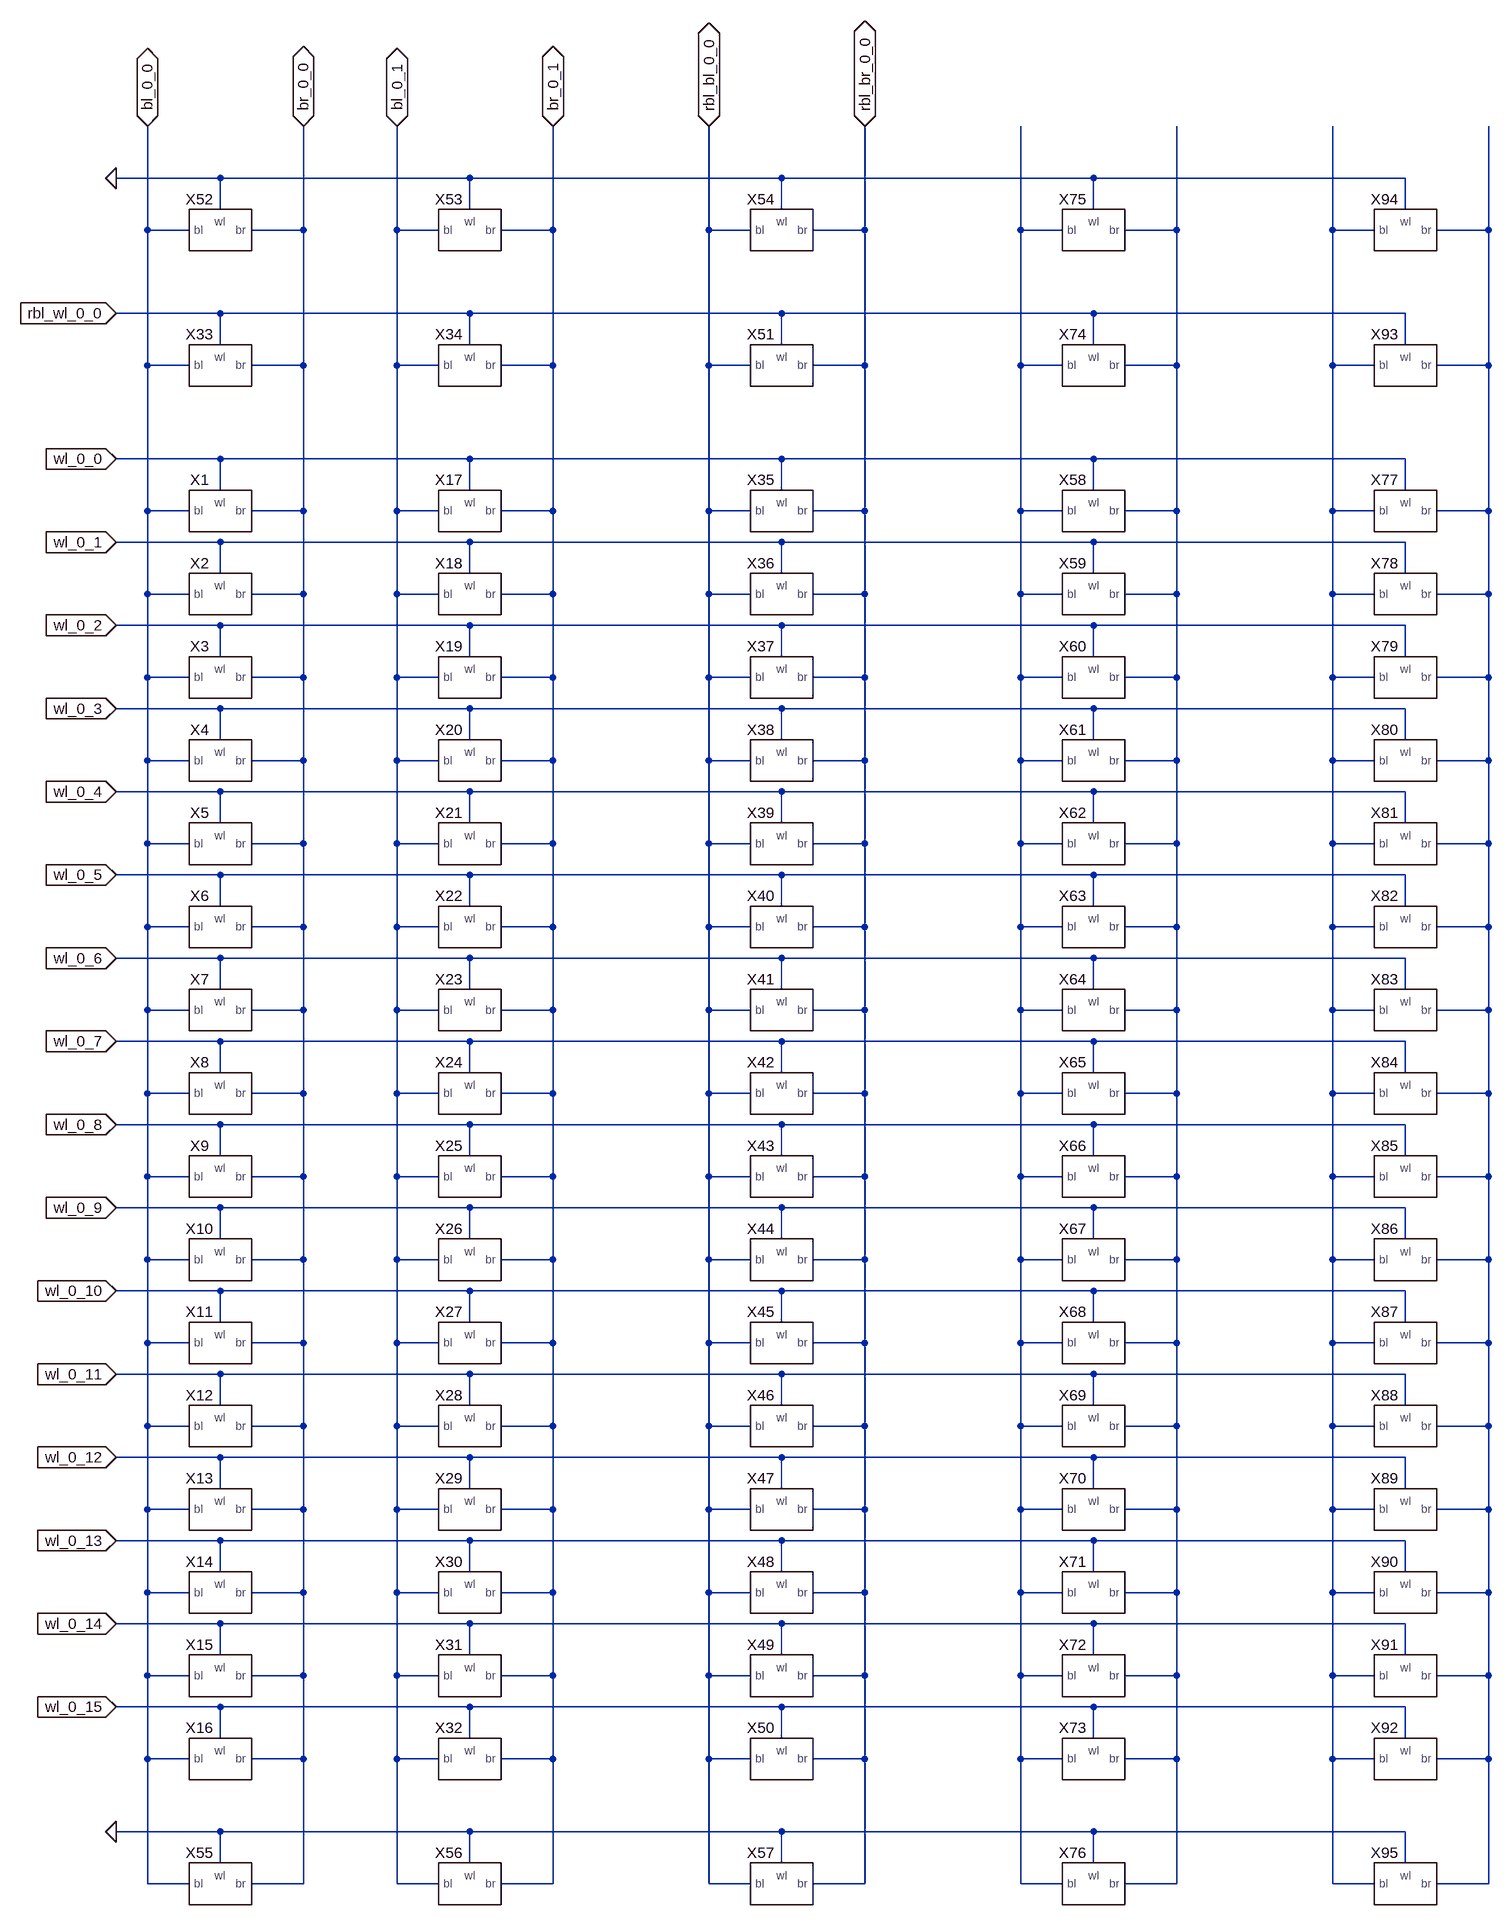
[diagram p0: schematic sram_16x2_bitcell_array_analysis.asc]
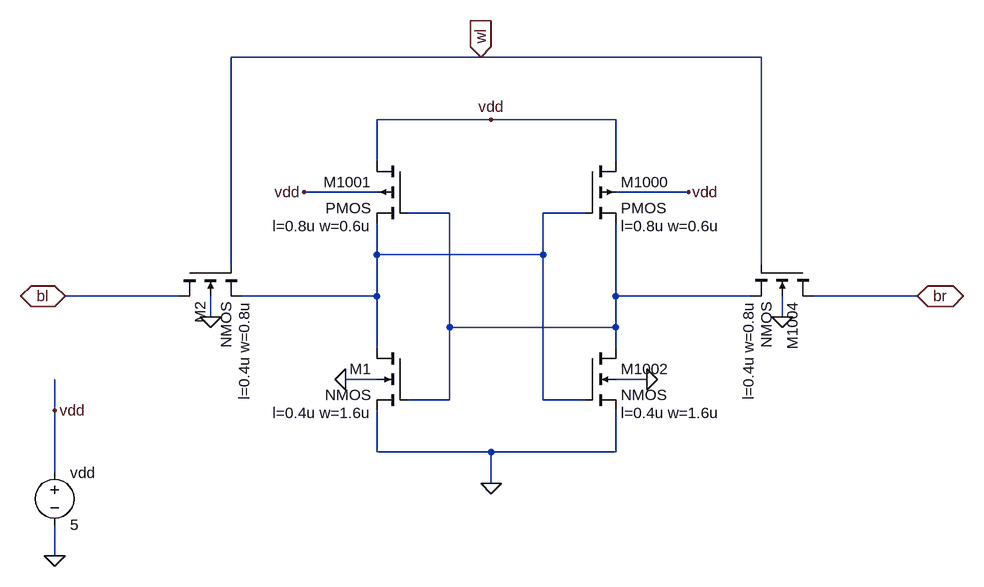
[diagram p1: sub-circuit cell_1rw.asc]
sram_16x2_bitcell_array_analysis.asc, the LTspice schematic file:
Version 4
SHEET 1 1192 1796
WIRE -848 -864 -1008 -864
WIRE -464 -864 -848 -864
WIRE 16 -864 -464 -864
WIRE 496 -864 16 -864
WIRE 976 -864 496 -864
WIRE -848 -816 -848 -864
WIRE -464 -816 -464 -864
WIRE 16 -816 16 -864
WIRE 496 -816 496 -864
WIRE 976 -816 976 -864
WIRE -960 -784 -960 -944
WIRE -896 -784 -960 -784
WIRE -720 -784 -720 -944
WIRE -720 -784 -800 -784
WIRE -576 -784 -576 -944
WIRE -512 -784 -576 -784
WIRE -336 -784 -336 -944
WIRE -336 -784 -416 -784
WIRE -96 -784 -96 -944
WIRE -32 -784 -96 -784
WIRE 144 -784 144 -944
WIRE 144 -784 64 -784
WIRE 384 -784 384 -944
WIRE 448 -784 384 -784
WIRE 624 -784 624 -944
WIRE 624 -784 544 -784
WIRE 864 -784 864 -944
WIRE 928 -784 864 -784
WIRE 1104 -784 1104 -944
WIRE 1104 -784 1024 -784
WIRE -848 -656 -1008 -656
WIRE -464 -656 -848 -656
WIRE 16 -656 -464 -656
WIRE 496 -656 16 -656
WIRE 976 -656 496 -656
WIRE -848 -608 -848 -656
WIRE -464 -608 -464 -656
WIRE 16 -608 16 -656
WIRE 496 -608 496 -656
WIRE 976 -608 976 -656
WIRE -960 -576 -960 -784
WIRE -896 -576 -960 -576
WIRE -720 -576 -720 -784
WIRE -720 -576 -800 -576
WIRE -576 -576 -576 -784
WIRE -512 -576 -576 -576
WIRE -336 -576 -336 -784
WIRE -336 -576 -416 -576
WIRE -96 -576 -96 -784
WIRE -32 -576 -96 -576
WIRE 144 -576 144 -784
WIRE 144 -576 64 -576
WIRE 384 -576 384 -784
WIRE 448 -576 384 -576
WIRE 624 -576 624 -784
WIRE 624 -576 544 -576
WIRE 864 -576 864 -784
WIRE 928 -576 864 -576
WIRE 1104 -576 1104 -784
WIRE 1104 -576 1024 -576
WIRE -848 -432 -1008 -432
WIRE -464 -432 -848 -432
WIRE 16 -432 -464 -432
WIRE 496 -432 16 -432
WIRE 976 -432 496 -432
WIRE -848 -384 -848 -432
WIRE -464 -384 -464 -432
WIRE 16 -384 16 -432
WIRE 496 -384 496 -432
WIRE 976 -384 976 -432
WIRE -960 -352 -960 -576
WIRE -896 -352 -960 -352
WIRE -720 -352 -720 -576
WIRE -720 -352 -800 -352
WIRE -576 -352 -576 -576
WIRE -512 -352 -576 -352
WIRE -336 -352 -336 -576
WIRE -336 -352 -416 -352
WIRE -96 -352 -96 -576
WIRE -32 -352 -96 -352
WIRE 144 -352 144 -576
WIRE 144 -352 64 -352
WIRE 384 -352 384 -576
WIRE 448 -352 384 -352
WIRE 624 -352 624 -576
WIRE 624 -352 544 -352
WIRE 864 -352 864 -576
WIRE 928 -352 864 -352
WIRE 1104 -352 1104 -576
WIRE 1104 -352 1024 -352
WIRE -848 -304 -1008 -304
WIRE -464 -304 -848 -304
WIRE 16 -304 -464 -304
WIRE 496 -304 16 -304
WIRE 976 -304 496 -304
WIRE -848 -256 -848 -304
WIRE -464 -256 -464 -304
WIRE 16 -256 16 -304
WIRE 496 -256 496 -304
WIRE 976 -256 976 -304
WIRE -960 -224 -960 -352
WIRE -896 -224 -960 -224
WIRE -720 -224 -720 -352
WIRE -720 -224 -800 -224
WIRE -576 -224 -576 -352
WIRE -512 -224 -576 -224
WIRE -336 -224 -336 -352
WIRE -336 -224 -416 -224
WIRE -96 -224 -96 -352
WIRE -32 -224 -96 -224
WIRE 144 -224 144 -352
WIRE 144 -224 64 -224
WIRE 384 -224 384 -352
WIRE 448 -224 384 -224
WIRE 624 -224 624 -352
WIRE 624 -224 544 -224
WIRE 864 -224 864 -352
WIRE 928 -224 864 -224
WIRE 1104 -224 1104 -352
WIRE 1104 -224 1024 -224
WIRE -848 -176 -1008 -176
WIRE -464 -176 -848 -176
WIRE 16 -176 -464 -176
WIRE 496 -176 16 -176
WIRE 976 -176 496 -176
WIRE -848 -128 -848 -176
WIRE -464 -128 -464 -176
WIRE 16 -128 16 -176
WIRE 496 -128 496 -176
WIRE 976 -128 976 -176
WIRE -960 -96 -960 -224
WIRE -896 -96 -960 -96
WIRE -720 -96 -720 -224
WIRE -720 -96 -800 -96
WIRE -576 -96 -576 -224
WIRE -512 -96 -576 -96
WIRE -336 -96 -336 -224
WIRE -336 -96 -416 -96
WIRE -96 -96 -96 -224
WIRE -32 -96 -96 -96
WIRE 144 -96 144 -224
WIRE 144 -96 64 -96
WIRE 384 -96 384 -224
WIRE 448 -96 384 -96
WIRE 624 -96 624 -224
WIRE 624 -96 544 -96
WIRE 864 -96 864 -224
WIRE 928 -96 864 -96
WIRE 1104 -96 1104 -224
WIRE 1104 -96 1024 -96
WIRE -848 -48 -1008 -48
WIRE -464 -48 -848 -48
WIRE 16 -48 -464 -48
WIRE 496 -48 16 -48
WIRE 976 -48 496 -48
WIRE -848 0 -848 -48
WIRE -464 0 -464 -48
WIRE 16 0 16 -48
WIRE 496 0 496 -48
WIRE 976 0 976 -48
WIRE -960 32 -960 -96
WIRE -896 32 -960 32
WIRE -720 32 -720 -96
WIRE -720 32 -800 32
WIRE -576 32 -576 -96
WIRE -512 32 -576 32
WIRE -336 32 -336 -96
WIRE -336 32 -416 32
WIRE -96 32 -96 -96
WIRE -32 32 -96 32
WIRE 144 32 144 -96
WIRE 144 32 64 32
WIRE 384 32 384 -96
WIRE 448 32 384 32
WIRE 624 32 624 -96
WIRE 624 32 544 32
WIRE 864 32 864 -96
WIRE 928 32 864 32
WIRE 1104 32 1104 -96
WIRE 1104 32 1024 32
WIRE -848 80 -1008 80
WIRE -464 80 -848 80
WIRE 16 80 -464 80
WIRE 496 80 16 80
WIRE 976 80 496 80
WIRE -848 128 -848 80
WIRE -464 128 -464 80
WIRE 16 128 16 80
WIRE 496 128 496 80
WIRE 976 128 976 80
WIRE -960 160 -960 32
WIRE -896 160 -960 160
WIRE -720 160 -720 32
WIRE -720 160 -800 160
WIRE -576 160 -576 32
WIRE -512 160 -576 160
WIRE -336 160 -336 32
WIRE -336 160 -416 160
WIRE -96 160 -96 32
WIRE -32 160 -96 160
WIRE 144 160 144 32
WIRE 144 160 64 160
WIRE 384 160 384 32
WIRE 448 160 384 160
WIRE 624 160 624 32
WIRE 624 160 544 160
WIRE 864 160 864 32
WIRE 928 160 864 160
WIRE 1104 160 1104 32
WIRE 1104 160 1024 160
WIRE -848 208 -1008 208
WIRE -464 208 -848 208
WIRE 16 208 -464 208
WIRE 496 208 16 208
WIRE 976 208 496 208
WIRE -848 256 -848 208
WIRE -464 256 -464 208
WIRE 16 256 16 208
WIRE 496 256 496 208
WIRE 976 256 976 208
WIRE -960 288 -960 160
WIRE -896 288 -960 288
WIRE -720 288 -720 160
WIRE -720 288 -800 288
WIRE -576 288 -576 160
WIRE -512 288 -576 288
WIRE -336 288 -336 160
WIRE -336 288 -416 288
WIRE -96 288 -96 160
WIRE -32 288 -96 288
WIRE 144 288 144 160
WIRE 144 288 64 288
WIRE 384 288 384 160
WIRE 448 288 384 288
WIRE 624 288 624 160
WIRE 624 288 544 288
WIRE 864 288 864 160
WIRE 928 288 864 288
WIRE 1104 288 1104 160
WIRE 1104 288 1024 288
WIRE -848 336 -1008 336
WIRE -464 336 -848 336
WIRE 16 336 -464 336
WIRE 496 336 16 336
WIRE 976 336 496 336
WIRE -848 384 -848 336
WIRE -464 384 -464 336
WIRE 16 384 16 336
WIRE 496 384 496 336
WIRE 976 384 976 336
WIRE -960 416 -960 288
WIRE -896 416 -960 416
WIRE -720 416 -720 288
WIRE -720 416 -800 416
WIRE -576 416 -576 288
WIRE -512 416 -576 416
WIRE -336 416 -336 288
WIRE -336 416 -416 416
WIRE -96 416 -96 288
WIRE -32 416 -96 416
WIRE 144 416 144 288
WIRE 144 416 64 416
WIRE 384 416 384 288
WIRE 448 416 384 416
WIRE 624 416 624 288
WIRE 624 416 544 416
WIRE 864 416 864 288
WIRE 928 416 864 416
WIRE 1104 416 1104 288
WIRE 1104 416 1024 416
WIRE -848 464 -1008 464
WIRE -464 464 -848 464
WIRE 16 464 -464 464
WIRE 496 464 16 464
WIRE 976 464 496 464
WIRE -848 512 -848 464
WIRE -464 512 -464 464
WIRE 16 512 16 464
WIRE 496 512 496 464
WIRE 976 512 976 464
WIRE -960 544 -960 416
WIRE -896 544 -960 544
WIRE -720 544 -720 416
WIRE -720 544 -800 544
WIRE -576 544 -576 416
WIRE -512 544 -576 544
WIRE -336 544 -336 416
WIRE -336 544 -416 544
WIRE -96 544 -96 416
WIRE -32 544 -96 544
WIRE 144 544 144 416
WIRE 144 544 64 544
WIRE 384 544 384 416
WIRE 448 544 384 544
WIRE 624 544 624 416
WIRE 624 544 544 544
WIRE 864 544 864 416
WIRE 928 544 864 544
WIRE 1104 544 1104 416
WIRE 1104 544 1024 544
WIRE -848 592 -1008 592
WIRE -464 592 -848 592
WIRE 16 592 -464 592
WIRE 496 592 16 592
WIRE 976 592 496 592
WIRE -848 640 -848 592
WIRE -464 640 -464 592
WIRE 16 640 16 592
WIRE 496 640 496 592
WIRE 976 640 976 592
WIRE -960 672 -960 544
WIRE -896 672 -960 672
WIRE -720 672 -720 544
WIRE -720 672 -800 672
WIRE -576 672 -576 544
WIRE -512 672 -576 672
WIRE -336 672 -336 544
WIRE -336 672 -416 672
WIRE -96 672 -96 544
WIRE -32 672 -96 672
WIRE 144 672 144 544
WIRE 144 672 64 672
WIRE 384 672 384 544
WIRE 448 672 384 672
WIRE 624 672 624 544
WIRE 624 672 544 672
WIRE 864 672 864 544
WIRE 928 672 864 672
WIRE 1104 672 1104 544
WIRE 1104 672 1024 672
WIRE -848 720 -1008 720
WIRE -464 720 -848 720
WIRE 16 720 -464 720
WIRE 496 720 16 720
WIRE 976 720 496 720
WIRE -848 768 -848 720
WIRE -464 768 -464 720
WIRE 16 768 16 720
WIRE 496 768 496 720
WIRE 976 768 976 720
WIRE -960 800 -960 672
WIRE -896 800 -960 800
WIRE -720 800 -720 672
WIRE -720 800 -800 800
WIRE -576 800 -576 672
WIRE -512 800 -576 800
WIRE -336 800 -336 672
WIRE -336 800 -416 800
WIRE -96 800 -96 672
WIRE -32 800 -96 800
WIRE 144 800 144 672
WIRE 144 800 64 800
WIRE 384 800 384 672
WIRE 448 800 384 800
WIRE 624 800 624 672
WIRE 624 800 544 800
WIRE 864 800 864 672
WIRE 928 800 864 800
WIRE 1104 800 1104 672
WIRE 1104 800 1024 800
WIRE -848 848 -1008 848
WIRE -464 848 -848 848
WIRE 16 848 -464 848
WIRE 496 848 16 848
WIRE 976 848 496 848
WIRE -848 896 -848 848
WIRE -464 896 -464 848
WIRE 16 896 16 848
WIRE 496 896 496 848
WIRE 976 896 976 848
WIRE -960 928 -960 800
WIRE -896 928 -960 928
WIRE -720 928 -720 800
WIRE -720 928 -800 928
WIRE -576 928 -576 800
WIRE -512 928 -576 928
WIRE -336 928 -336 800
WIRE -336 928 -416 928
WIRE -96 928 -96 800
WIRE -32 928 -96 928
WIRE 144 928 144 800
WIRE 144 928 64 928
WIRE 384 928 384 800
WIRE 448 928 384 928
WIRE 624 928 624 800
WIRE 624 928 544 928
WIRE 864 928 864 800
WIRE 928 928 864 928
WIRE 1104 928 1104 800
WIRE 1104 928 1024 928
WIRE -848 976 -1008 976
WIRE -464 976 -848 976
WIRE 16 976 -464 976
WIRE 496 976 16 976
WIRE 976 976 496 976
WIRE -848 1024 -848 976
WIRE -464 1024 -464 976
WIRE 16 1024 16 976
WIRE 496 1024 496 976
WIRE 976 1024 976 976
WIRE -960 1056 -960 928
WIRE -896 1056 -960 1056
WIRE -720 1056 -720 928
WIRE -720 1056 -800 1056
WIRE -576 1056 -576 928
WIRE -512 1056 -576 1056
WIRE -336 1056 -336 928
WIRE -336 1056 -416 1056
WIRE -96 1056 -96 928
WIRE -32 1056 -96 1056
WIRE 144 1056 144 928
WIRE 144 1056 64 1056
WIRE 384 1056 384 928
WIRE 448 1056 384 1056
WIRE 624 1056 624 928
WIRE 624 1056 544 1056
WIRE 864 1056 864 928
WIRE 928 1056 864 1056
WIRE 1104 1056 1104 928
WIRE 1104 1056 1024 1056
WIRE -848 1104 -1008 1104
WIRE -464 1104 -848 1104
WIRE 16 1104 -464 1104
WIRE 496 1104 16 1104
WIRE 976 1104 496 1104
WIRE -848 1152 -848 1104
WIRE -464 1152 -464 1104
WIRE 16 1152 16 1104
WIRE 496 1152 496 1104
WIRE 976 1152 976 1104
WIRE -960 1184 -960 1056
WIRE -896 1184 -960 1184
WIRE -720 1184 -720 1056
WIRE -720 1184 -800 1184
WIRE -576 1184 -576 1056
WIRE -512 1184 -576 1184
WIRE -336 1184 -336 1056
WIRE -336 1184 -416 1184
WIRE -96 1184 -96 1056
WIRE -32 1184 -96 1184
WIRE 144 1184 144 1056
WIRE 144 1184 64 1184
WIRE 384 1184 384 1056
WIRE 448 1184 384 1184
WIRE 624 1184 624 1056
WIRE 624 1184 544 1184
WIRE 864 1184 864 1056
WIRE 928 1184 864 1184
WIRE 1104 1184 1104 1056
WIRE 1104 1184 1024 1184
WIRE -848 1232 -1008 1232
WIRE -464 1232 -848 1232
WIRE 16 1232 -464 1232
WIRE 496 1232 16 1232
WIRE 976 1232 496 1232
WIRE -848 1280 -848 1232
WIRE -464 1280 -464 1232
WIRE 16 1280 16 1232
WIRE 496 1280 496 1232
WIRE 976 1280 976 1232
WIRE -960 1312 -960 1184
WIRE -896 1312 -960 1312
WIRE -720 1312 -720 1184
WIRE -720 1312 -800 1312
WIRE -576 1312 -576 1184
WIRE -512 1312 -576 1312
WIRE -336 1312 -336 1184
WIRE -336 1312 -416 1312
WIRE -96 1312 -96 1184
WIRE -32 1312 -96 1312
WIRE 144 1312 144 1184
WIRE 144 1312 64 1312
WIRE 384 1312 384 1184
WIRE 448 1312 384 1312
WIRE 624 1312 624 1184
WIRE 624 1312 544 1312
WIRE 864 1312 864 1184
WIRE 928 1312 864 1312
WIRE 1104 1312 1104 1184
WIRE 1104 1312 1024 1312
WIRE -848 1360 -1008 1360
WIRE -464 1360 -848 1360
WIRE 16 1360 -464 1360
WIRE 496 1360 16 1360
WIRE 976 1360 496 1360
WIRE -848 1408 -848 1360
WIRE -464 1408 -464 1360
WIRE 16 1408 16 1360
WIRE 496 1408 496 1360
WIRE 976 1408 976 1360
WIRE -960 1440 -960 1312
WIRE -896 1440 -960 1440
WIRE -720 1440 -720 1312
WIRE -720 1440 -800 1440
WIRE -576 1440 -576 1312
WIRE -512 1440 -576 1440
WIRE -336 1440 -336 1312
WIRE -336 1440 -416 1440
WIRE -96 1440 -96 1312
WIRE -32 1440 -96 1440
WIRE 144 1440 144 1312
WIRE 144 1440 64 1440
WIRE 384 1440 384 1312
WIRE 448 1440 384 1440
WIRE 624 1440 624 1312
WIRE 624 1440 544 1440
WIRE 864 1440 864 1312
WIRE 928 1440 864 1440
WIRE 1104 1440 1104 1312
WIRE 1104 1440 1024 1440
WIRE -848 1488 -1008 1488
WIRE -464 1488 -848 1488
WIRE 16 1488 -464 1488
WIRE 496 1488 16 1488
WIRE 976 1488 496 1488
WIRE -848 1536 -848 1488
WIRE -464 1536 -464 1488
WIRE 16 1536 16 1488
WIRE 496 1536 496 1488
WIRE 976 1536 976 1488
WIRE -960 1568 -960 1440
WIRE -896 1568 -960 1568
WIRE -720 1568 -720 1440
WIRE -720 1568 -800 1568
WIRE -576 1568 -576 1440
WIRE -512 1568 -576 1568
WIRE -336 1568 -336 1440
WIRE -336 1568 -416 1568
WIRE -96 1568 -96 1440
WIRE -32 1568 -96 1568
WIRE 144 1568 144 1440
WIRE 144 1568 64 1568
WIRE 384 1568 384 1440
WIRE 448 1568 384 1568
WIRE 624 1568 624 1440
WIRE 624 1568 544 1568
WIRE 864 1568 864 1440
WIRE 928 1568 864 1568
WIRE 1104 1568 1104 1440
WIRE 1104 1568 1024 1568
WIRE -848 1680 -1008 1680
WIRE -464 1680 -848 1680
WIRE 16 1680 -464 1680
WIRE 496 1680 16 1680
WIRE 976 1680 496 1680
WIRE -848 1728 -848 1680
WIRE -464 1728 -464 1680
WIRE 16 1728 16 1680
WIRE 496 1728 496 1680
WIRE 976 1728 976 1680
WIRE -960 1760 -960 1568
WIRE -896 1760 -960 1760
WIRE -720 1760 -720 1568
WIRE -720 1760 -800 1760
WIRE -576 1760 -576 1568
WIRE -512 1760 -576 1760
WIRE -336 1760 -336 1568
WIRE -336 1760 -416 1760
WIRE -96 1760 -96 1568
WIRE -32 1760 -96 1760
WIRE 144 1760 144 1568
WIRE 144 1760 64 1760
WIRE 384 1760 384 1568
WIRE 448 1760 384 1760
WIRE 624 1760 624 1568
WIRE 624 1760 544 1760
WIRE 864 1760 864 1568
WIRE 928 1760 864 1760
WIRE 1104 1760 1104 1568
WIRE 1104 1760 1024 1760
FLAG -1008 -432 wl_0_0
IOPIN -1008 -432 In
FLAG -1008 -304 wl_0_1
IOPIN -1008 -304 In
FLAG -1008 -176 wl_0_2
IOPIN -1008 -176 In
FLAG -1008 -48 wl_0_3
IOPIN -1008 -48 In
FLAG -1008 80 wl_0_4
IOPIN -1008 80 In
FLAG -1008 208 wl_0_5
IOPIN -1008 208 In
FLAG -1008 336 wl_0_6
IOPIN -1008 336 In
FLAG -1008 464 wl_0_7
IOPIN -1008 464 In
FLAG -1008 592 wl_0_8
IOPIN -1008 592 In
FLAG -1008 720 wl_0_9
IOPIN -1008 720 In
FLAG -1008 848 wl_0_10
IOPIN -1008 848 In
FLAG -1008 976 wl_0_11
IOPIN -1008 976 In
FLAG -1008 1104 wl_0_12
IOPIN -1008 1104 In
FLAG -1008 1232 wl_0_13
IOPIN -1008 1232 In
FLAG -1008 1360 wl_0_14
IOPIN -1008 1360 In
FLAG -1008 1488 wl_0_15
IOPIN -1008 1488 In
FLAG -960 -944 bl_0_0
IOPIN -960 -944 BiDir
FLAG -720 -944 br_0_0
IOPIN -720 -944 BiDir
FLAG -576 -944 bl_0_1
IOPIN -576 -944 BiDir
FLAG -336 -944 br_0_1
IOPIN -336 -944 BiDir
FLAG -1008 -656 rbl_wl_0_0
IOPIN -1008 -656 In
FLAG -96 -944 rbl_bl_0_0
IOPIN -96 -944 BiDir
FLAG 144 -944 rbl_br_0_0
IOPIN 144 -944 BiDir
FLAG -1008 -864 0
FLAG -1008 1680 0
SYMBOL cell_1rw -848 -352 R0
SYMATTR InstName X1
SYMBOL cell_1rw -848 -224 R0
SYMATTR InstName X2
SYMBOL cell_1rw -848 -96 R0
SYMATTR InstName X3
SYMBOL cell_1rw -848 32 R0
SYMATTR InstName X4
SYMBOL cell_1rw -848 160 R0
SYMATTR InstName X5
SYMBOL cell_1rw -848 288 R0
SYMATTR InstName X6
SYMBOL cell_1rw -848 416 R0
SYMATTR InstName X7
SYMBOL cell_1rw -848 544 R0
SYMATTR InstName X8
SYMBOL cell_1rw -848 672 R0
SYMATTR InstName X9
SYMBOL cell_1rw -848 800 R0
SYMATTR InstName X10
SYMBOL cell_1rw -848 928 R0
SYMATTR InstName X11
SYMBOL cell_1rw -848 1056 R0
SYMATTR InstName X12
SYMBOL cell_1rw -848 1184 R0
SYMATTR InstName X13
SYMBOL cell_1rw -848 1312 R0
SYMATTR InstName X14
SYMBOL cell_1rw -848 1440 R0
SYMATTR InstName X15
SYMBOL cell_1rw -848 1568 R0
SYMATTR InstName X16
SYMBOL cell_1rw -464 -352 R0
SYMATTR InstName X17
SYMBOL cell_1rw -464 -224 R0
SYMATTR InstName X18
SYMBOL cell_1rw -464 -96 R0
SYMATTR InstName X19
SYMBOL cell_1rw -464 32 R0
SYMATTR InstName X20
SYMBOL cell_1rw -464 160 R0
SYMATTR InstName X21
SYMBOL cell_1rw -464 288 R0
SYMATTR InstName X22
SYMBOL cell_1rw -464 416 R0
SYMATTR InstName X23
SYMBOL cell_1rw -464 544 R0
SYMATTR InstName X24
SYMBOL cell_1rw -464 672 R0
SYMATTR InstName X25
SYMBOL cell_1rw -464 800 R0
SYMATTR InstName X26
SYMBOL cell_1rw -464 928 R0
SYMATTR InstName X27
SYMBOL cell_1rw -464 1056 R0
SYMATTR InstName X28
SYMBOL cell_1rw -464 1184 R0
SYMATTR InstName X29
SYMBOL cell_1rw -464 1312 R0
SYMATTR InstName X30
SYMBOL cell_1rw -464 1440 R0
SYMATTR InstName X31
SYMBOL cell_1rw -464 1568 R0
SYMATTR InstName X32
SYMBOL cell_1rw -848 -576 R0
SYMATTR InstName X33
SYMBOL cell_1rw -464 -576 R0
SYMATTR InstName X34
SYMBOL cell_1rw 16 -352 R0
SYMATTR InstName X35
SYMBOL cell_1rw 16 -224 R0
SYMATTR InstName X36
SYMBOL cell_1rw 16 -96 R0
SYMATTR InstName X37
SYMBOL cell_1rw 16 32 R0
SYMATTR InstName X38
SYMBOL cell_1rw 16 160 R0
SYMATTR InstName X39
SYMBOL cell_1rw 16 288 R0
SYMATTR InstName X40
SYMBOL cell_1rw 16 416 R0
SYMATTR InstName X41
SYMBOL cell_1rw 16 544 R0
SYMATTR InstName X42
SYMBOL cell_1rw 16 672 R0
SYMATTR InstName X43
SYMBOL cell_1rw 16 800 R0
SYMATTR InstName X44
SYMBOL cell_1rw 16 928 R0
SYMATTR InstName X45
SYMBOL cell_1rw 16 1056 R0
SYMATTR InstName X46
SYMBOL cell_1rw 16 1184 R0
SYMATTR InstName X47
SYMBOL cell_1rw 16 1312 R0
SYMATTR InstName X48
SYMBOL cell_1rw 16 1440 R0
SYMATTR InstName X49
SYMBOL cell_1rw 16 1568 R0
SYMATTR InstName X50
SYMBOL cell_1rw 16 -576 R0
SYMATTR InstName X51
SYMBOL cell_1rw -848 -784 R0
SYMATTR InstName X52
SYMBOL cell_1rw -464 -784 R0
SYMATTR InstName X53
SYMBOL cell_1rw 16 -784 R0
SYMATTR InstName X54
SYMBOL cell_1rw -848 1760 R0
SYMATTR InstName X55
SYMBOL cell_1rw -464 1760 R0
SYMATTR InstName X56
SYMBOL cell_1rw 16 1760 R0
SYMATTR InstName X57
SYMBOL cell_1rw 496 -352 R0
SYMATTR InstName X58
SYMBOL cell_1rw 496 -224 R0
SYMATTR InstName X59
SYMBOL cell_1rw 496 -96 R0
SYMATTR InstName X60
SYMBOL cell_1rw 496 32 R0
SYMATTR InstName X61
SYMBOL cell_1rw 496 160 R0
SYMATTR InstName X62
SYMBOL cell_1rw 496 288 R0
SYMATTR InstName X63
SYMBOL cell_1rw 496 416 R0
SYMATTR InstName X64
SYMBOL cell_1rw 496 544 R0
SYMATTR InstName X65
SYMBOL cell_1rw 496 672 R0
SYMATTR InstName X66
SYMBOL cell_1rw 496 800 R0
SYMATTR InstName X67
SYMBOL cell_1rw 496 928 R0
SYMATTR InstName X68
SYMBOL cell_1rw 496 1056 R0
SYMATTR InstName X69
SYMBOL cell_1rw 496 1184 R0
SYMATTR InstName X70
SYMBOL cell_1rw 496 1312 R0
SYMATTR InstName X71
SYMBOL cell_1rw 496 1440 R0
SYMATTR InstName X72
SYMBOL cell_1rw 496 1568 R0
SYMATTR InstName X73
SYMBOL cell_1rw 496 -576 R0
SYMATTR InstName X74
SYMBOL cell_1rw 496 -784 R0
SYMATTR InstName X75
SYMBOL cell_1rw 496 1760 R0
SYMATTR InstName X76
SYMBOL cell_1rw 976 -352 R0
SYMATTR InstName X77
SYMBOL cell_1rw 976 -224 R0
SYMATTR InstName X78
SYMBOL cell_1rw 976 -96 R0
SYMATTR InstName X79
SYMBOL cell_1rw 976 32 R0
SYMATTR InstName X80
SYMBOL cell_1rw 976 160 R0
SYMATTR InstName X81
SYMBOL cell_1rw 976 288 R0
SYMATTR InstName X82
SYMBOL cell_1rw 976 416 R0
SYMATTR InstName X83
SYMBOL cell_1rw 976 544 R0
SYMATTR InstName X84
SYMBOL cell_1rw 976 672 R0
SYMATTR InstName X85
SYMBOL cell_1rw 976 800 R0
SYMATTR InstName X86
SYMBOL cell_1rw 976 928 R0
SYMATTR InstName X87
SYMBOL cell_1rw 976 1056 R0
SYMATTR InstName X88
SYMBOL cell_1rw 976 1184 R0
SYMATTR InstName X89
SYMBOL cell_1rw 976 1312 R0
SYMATTR InstName X90
SYMBOL cell_1rw 976 1440 R0
SYMATTR InstName X91
SYMBOL cell_1rw 976 1568 R0
SYMATTR InstName X92
SYMBOL cell_1rw 976 -576 R0
SYMATTR InstName X93
SYMBOL cell_1rw 976 -784 R0
SYMATTR InstName X94
SYMBOL cell_1rw 976 1760 R0
SYMATTR InstName X95

cell_1rw.asc, the sub-circuit schematic file:
Version 4
SHEET 1 916 708
WIRE 160 -80 -224 -80
WIRE 592 -80 160 -80
WIRE 176 16 0 16
WIRE 368 16 176 16
WIRE 0 80 0 16
WIRE 368 80 368 16
WIRE 0 128 -112 128
WIRE 480 128 368 128
WIRE 112 160 48 160
WIRE 320 160 256 160
WIRE 0 224 0 176
WIRE 256 224 256 160
WIRE 256 224 0 224
WIRE -224 240 -224 -80
WIRE 592 240 592 -80
WIRE -304 288 -480 288
WIRE 0 288 0 224
WIRE 0 288 -208 288
WIRE 368 288 368 176
WIRE 576 288 368 288
WIRE 832 288 672 288
WIRE -256 320 -256 288
WIRE 624 320 624 288
WIRE 112 336 112 160
WIRE 368 336 368 288
WIRE 368 336 112 336
WIRE 0 368 0 288
WIRE 368 368 368 336
WIRE 0 416 -48 416
WIRE 416 416 368 416
WIRE 112 448 112 336
WIRE 112 448 48 448
WIRE 256 448 256 224
WIRE 320 448 256 448
WIRE -496 464 -496 416
WIRE 0 528 0 464
WIRE 176 528 0 528
WIRE 368 528 368 464
WIRE 368 528 176 528
WIRE -496 560 -496 464
WIRE 176 576 176 528
WIRE -496 688 -496 640
FLAG 176 576 0
FLAG -496 688 0
FLAG -496 464 vdd
FLAG 176 16 vdd
FLAG 416 416 0
FLAG -48 416 0
FLAG 624 320 0
FLAG -256 320 0
FLAG -112 128 vdd
FLAG 480 128 vdd
FLAG -480 288 bl
IOPIN -480 288 BiDir
FLAG 160 -80 wl
IOPIN 160 -80 In
FLAG 832 288 br
IOPIN 832 288 BiDir
SYMBOL pmos4 320 80 R0
WINDOW 123 56 100 Left 2
SYMATTR InstName M1000
SYMATTR Value2 l=0.8u w=0.6u
SYMBOL pmos4 48 80 M0
WINDOW 123 56 100 Left 2
SYMATTR InstName M1001
SYMATTR Value2 l=0.8u w=0.6u
SYMBOL nmos4 320 368 R0
WINDOW 123 56 100 Left 2
SYMATTR InstName M1002
SYMATTR Value2 l=0.4u w=1.6u
SYMBOL nmos4 48 368 M0
WINDOW 123 56 100 Left 2
SYMATTR InstName M1
SYMATTR Value2 l=0.4u w=1.6u
SYMBOL voltage -496 544 R0
WINDOW 123 0 0 Left 0
WINDOW 39 0 0 Left 0
SYMATTR InstName vdd
SYMATTR Value 5
SYMBOL nmos4 672 240 R90
WINDOW 123 56 100 Left 2
SYMATTR InstName M1004
SYMATTR Value2 l=0.4u w=0.8u
SYMBOL nmos4 -304 240 M90
WINDOW 123 56 100 Left 2
SYMATTR InstName M2
SYMATTR Value2 l=0.4u w=0.8u

The netlist it stands for:
* sram_16x2_bitcell_array_analysis.asc
XX1 wl_0_0 bl_0_0 br_0_0 cell_1rw
XX2 wl_0_1 bl_0_0 br_0_0 cell_1rw
XX3 wl_0_2 bl_0_0 br_0_0 cell_1rw
XX4 wl_0_3 bl_0_0 br_0_0 cell_1rw
XX5 wl_0_4 bl_0_0 br_0_0 cell_1rw
XX6 wl_0_5 bl_0_0 br_0_0 cell_1rw
XX7 wl_0_6 bl_0_0 br_0_0 cell_1rw
XX8 wl_0_7 bl_0_0 br_0_0 cell_1rw
XX9 wl_0_8 bl_0_0 br_0_0 cell_1rw
XX10 wl_0_9 bl_0_0 br_0_0 cell_1rw
XX11 wl_0_10 bl_0_0 br_0_0 cell_1rw
XX12 wl_0_11 bl_0_0 br_0_0 cell_1rw
XX13 wl_0_12 bl_0_0 br_0_0 cell_1rw
XX14 wl_0_13 bl_0_0 br_0_0 cell_1rw
XX15 wl_0_14 bl_0_0 br_0_0 cell_1rw
XX16 wl_0_15 bl_0_0 br_0_0 cell_1rw
XX17 wl_0_0 bl_0_1 br_0_1 cell_1rw
XX18 wl_0_1 bl_0_1 br_0_1 cell_1rw
XX19 wl_0_2 bl_0_1 br_0_1 cell_1rw
XX20 wl_0_3 bl_0_1 br_0_1 cell_1rw
XX21 wl_0_4 bl_0_1 br_0_1 cell_1rw
XX22 wl_0_5 bl_0_1 br_0_1 cell_1rw
XX23 wl_0_6 bl_0_1 br_0_1 cell_1rw
XX24 wl_0_7 bl_0_1 br_0_1 cell_1rw
XX25 wl_0_8 bl_0_1 br_0_1 cell_1rw
XX26 wl_0_9 bl_0_1 br_0_1 cell_1rw
XX27 wl_0_10 bl_0_1 br_0_1 cell_1rw
XX28 wl_0_11 bl_0_1 br_0_1 cell_1rw
XX29 wl_0_12 bl_0_1 br_0_1 cell_1rw
XX30 wl_0_13 bl_0_1 br_0_1 cell_1rw
XX31 wl_0_14 bl_0_1 br_0_1 cell_1rw
XX32 wl_0_15 bl_0_1 br_0_1 cell_1rw
XX33 rbl_wl_0_0 bl_0_0 br_0_0 cell_1rw
XX34 rbl_wl_0_0 bl_0_1 br_0_1 cell_1rw
XX35 wl_0_0 rbl_bl_0_0 rbl_br_0_0 cell_1rw
XX36 wl_0_1 rbl_bl_0_0 rbl_br_0_0 cell_1rw
XX37 wl_0_2 rbl_bl_0_0 rbl_br_0_0 cell_1rw
XX38 wl_0_3 rbl_bl_0_0 rbl_br_0_0 cell_1rw
XX39 wl_0_4 rbl_bl_0_0 rbl_br_0_0 cell_1rw
XX40 wl_0_5 rbl_bl_0_0 rbl_br_0_0 cell_1rw
XX41 wl_0_6 rbl_bl_0_0 rbl_br_0_0 cell_1rw
XX42 wl_0_7 rbl_bl_0_0 rbl_br_0_0 cell_1rw
XX43 wl_0_8 rbl_bl_0_0 rbl_br_0_0 cell_1rw
XX44 wl_0_9 rbl_bl_0_0 rbl_br_0_0 cell_1rw
XX45 wl_0_10 rbl_bl_0_0 rbl_br_0_0 cell_1rw
XX46 wl_0_11 rbl_bl_0_0 rbl_br_0_0 cell_1rw
XX47 wl_0_12 rbl_bl_0_0 rbl_br_0_0 cell_1rw
XX48 wl_0_13 rbl_bl_0_0 rbl_br_0_0 cell_1rw
XX49 wl_0_14 rbl_bl_0_0 rbl_br_0_0 cell_1rw
XX50 wl_0_15 rbl_bl_0_0 rbl_br_0_0 cell_1rw
XX51 rbl_wl_0_0 rbl_bl_0_0 rbl_br_0_0 cell_1rw
XX52 0 bl_0_0 br_0_0 cell_1rw
XX53 0 bl_0_1 br_0_1 cell_1rw
XX54 0 rbl_bl_0_0 rbl_br_0_0 cell_1rw
XX55 0 bl_0_0 br_0_0 cell_1rw
XX56 0 bl_0_1 br_0_1 cell_1rw
XX57 0 rbl_bl_0_0 rbl_br_0_0 cell_1rw
XX58 wl_0_0 N001 N002 cell_1rw
XX59 wl_0_1 N001 N002 cell_1rw
XX60 wl_0_2 N001 N002 cell_1rw
XX61 wl_0_3 N001 N002 cell_1rw
XX62 wl_0_4 N001 N002 cell_1rw
XX63 wl_0_5 N001 N002 cell_1rw
XX64 wl_0_6 N001 N002 cell_1rw
XX65 wl_0_7 N001 N002 cell_1rw
XX66 wl_0_8 N001 N002 cell_1rw
XX67 wl_0_9 N001 N002 cell_1rw
XX68 wl_0_10 N001 N002 cell_1rw
XX69 wl_0_11 N001 N002 cell_1rw
XX70 wl_0_12 N001 N002 cell_1rw
XX71 wl_0_13 N001 N002 cell_1rw
XX72 wl_0_14 N001 N002 cell_1rw
XX73 wl_0_15 N001 N002 cell_1rw
XX74 rbl_wl_0_0 N001 N002 cell_1rw
XX75 0 N001 N002 cell_1rw
XX76 0 N001 N002 cell_1rw
XX77 wl_0_0 N003 N004 cell_1rw
XX78 wl_0_1 N003 N004 cell_1rw
XX79 wl_0_2 N003 N004 cell_1rw
XX80 wl_0_3 N003 N004 cell_1rw
XX81 wl_0_4 N003 N004 cell_1rw
XX82 wl_0_5 N003 N004 cell_1rw
XX83 wl_0_6 N003 N004 cell_1rw
XX84 wl_0_7 N003 N004 cell_1rw
XX85 wl_0_8 N003 N004 cell_1rw
XX86 wl_0_9 N003 N004 cell_1rw
XX87 wl_0_10 N003 N004 cell_1rw
XX88 wl_0_11 N003 N004 cell_1rw
XX89 wl_0_12 N003 N004 cell_1rw
XX90 wl_0_13 N003 N004 cell_1rw
XX91 wl_0_14 N003 N004 cell_1rw
XX92 wl_0_15 N003 N004 cell_1rw
XX93 rbl_wl_0_0 N003 N004 cell_1rw
XX94 0 N003 N004 cell_1rw
XX95 0 N003 N004 cell_1rw

* block symbol definitions
.subckt cell_1rw wl bl br
M1000 vdd N002 N001 vdd PMOS l=0.8u w=0.6u
M1001 vdd N001 N002 vdd PMOS l=0.8u w=0.6u
M1002 N001 N002 0 0 NMOS l=0.4u w=1.6u
M1 N002 N001 0 0 NMOS l=0.4u w=1.6u
vdd vdd 0 5
M1004 br wl N001 0 NMOS l=0.4u w=0.8u
M2 bl wl N002 0 NMOS l=0.4u w=0.8u
.ends cell_1rw

.model NMOS NMOS
.model PMOS PMOS
.lib standard.mos
.backanno
.end